# Altium schematic sheet UWBSubsystem.SchDoc
size A4; SheetNumber: 13; SheetTotal: 13
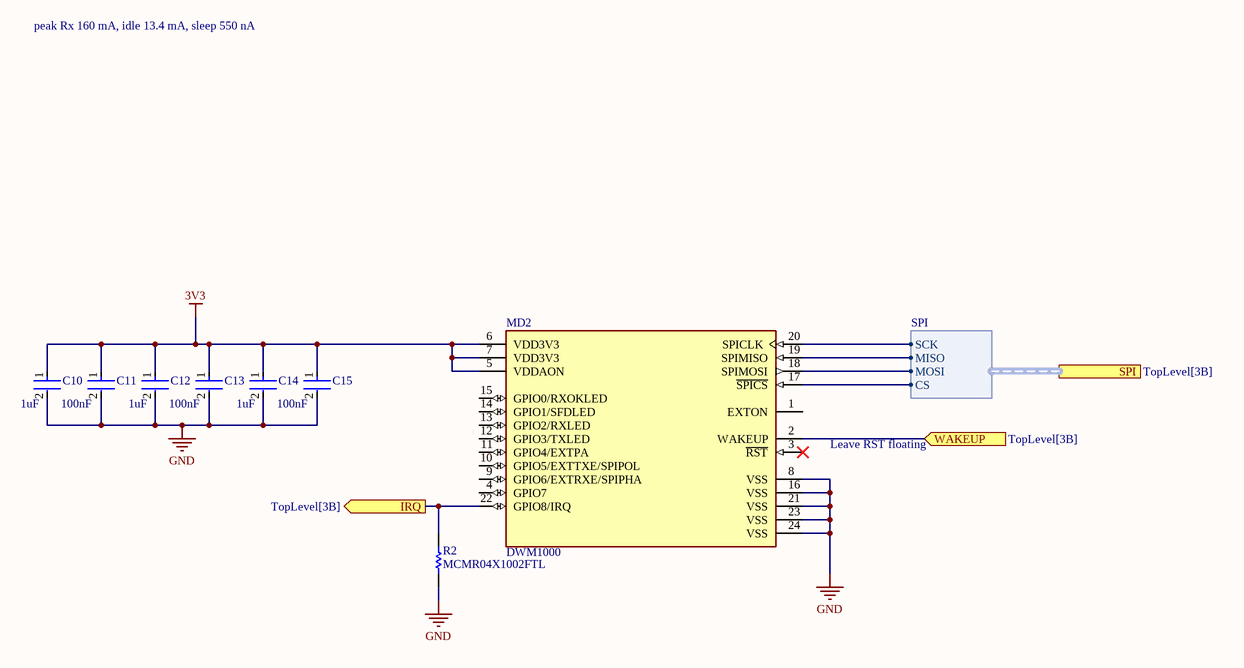
[diagram p0: UWBSubsystem.SchDoc]

## Parts
C10  Capacitance: 1uF  [FP-CL511-IPC_C]  (hidden comment: CL05A105KP5NNNC)
C11  Capacitance: 100nF  [FP-GRM155-0_05-IPC_C]  (hidden comment: GRM155R71E104KE14J)
C12  Capacitance: 1uF  [FP-CL511-IPC_C]  (hidden comment: CL05A105KP5NNNC)
C13  Capacitance: 100nF  [FP-GRM155-0_05-IPC_C]  (hidden comment: GRM155R71E104KE14J)
C14  Capacitance: 1uF  [FP-CL511-IPC_C]  (hidden comment: CL05A105KP5NNNC)
C15  Capacitance: 100nF  [FP-GRM155-0_05-IPC_C]  (hidden comment: GRM155R71E104KE14J)
MD2  DWM1000  [FP-DWM1000-MFG]
R2  MCMR04X1002FTL  [RESC1005X40X25NL05T10]

## Ports
IRQ (out, see TopLevel[3B]), SPI (harness SPI, see TopLevel[3B]), WAKEUP (in, see TopLevel[3B])

## Harnesses
SPI: SCK, MISO, MOSI, CS

## Nets
3V3: C10.1 C11.1 C12.1 C13.1 C14.1 C15.1 MD2.5(VDDAON) MD2.6(VDD3V3) MD2.7(VDD3V3)
GND: C10.2 C11.2 C12.2 C13.2 C14.2 C15.2 MD2.8(VSS) MD2.16(VSS) MD2.21(VSS) MD2.23(VSS) MD2.24(VSS) R2.1
IRQ: MD2.22(GPIO8/IRQ) R2.2 ; port IRQ
WAKEUP: MD2.2(WAKEUP) ; port WAKEUP
NetMD2_17: MD2.17(~{SPICS}) ; port SPI.CS
NetMD2_18: MD2.18(SPIMOSI) ; port SPI.MOSI
NetMD2_19: MD2.19(SPIMISO) ; port SPI.MISO
NetMD2_20: MD2.20(SPICLK) ; port SPI.SCK

Not connected (* = marked no-connect by the designer): MD2 1(EXTON) 3(~{RST})* 4(GPIO7) 9(GPIO6/EXTRXE/SPIPHA) 10(GPIO5/EXTTXE/SPIPOL) 11(GPIO4/EXTPA) 12(GPIO3/TXLED) 13(GPIO2/RXLED) 14(GPIO1/SFDLED) 15(GPIO0/RXOKLED)

## Notes on the sheet
- peak Rx 160 mA, idle 13.4 mA, sleep 550 nA
- Leave RST floating

## Library data of the parts
C10 C12 C14 = CMP-13271-001936-1: Cap Ceramic 1uF 10V X5R ±10% SMD 0402 +85°C Paper T/R; Depth: 0.5mm; Case Code (Imperial): 0402; Material: Ceramic; Mount: Surface Mount; Thickness: 0.022inch; Dielectric: X5R; Radiation Hardening: No; Case/Package: 0402; Length: 1mm; Tolerance: 10%; Max Operating Temperature: 85°C; Package Quantity: 1; Width: 0.02inch; Voltage Rating: 10V; Contact Plating: Tin; Height: 0.5mm; Min Operating Temperature: -55°C; Case Code (Metric): 1005; Packaging: Tape and Reel
C11 C13 C15 = CMP-06035-003995-1: Chip Multilayer Ceramic Capacitors for General Purpose, 0402, 0.10uF, X7R, 15%, 10%, 25V; Resistor Type: Ceramic; Tolerance: 10%; Case Code (Metric): 1005; Termination: SMD/SMT; Mount: Surface Mount; Voltage Rating: 25V; Voltage Rating (DC): 25V; Case Code (Imperial): 0402; Max Operating Temperature: 125°C; Weight: 0.000212oz; Case/Package: 0402; Length: 0.039inch; Width: 0.5mm; Thickness: 0.022inch; Height: 0.5mm; Packaging: Tape and Reel; Package Quantity: 50000; Min Operating Temperature: -55°C; Dielectric: X7R
MD2 = CMP-231853-000001-1: RX TXRX MODULE 802.15.4 CHIP SMD
R2 = CMP-2002-06479-1: Manufacturer: Multicomp; Part Number: MCMR04X1002FTL